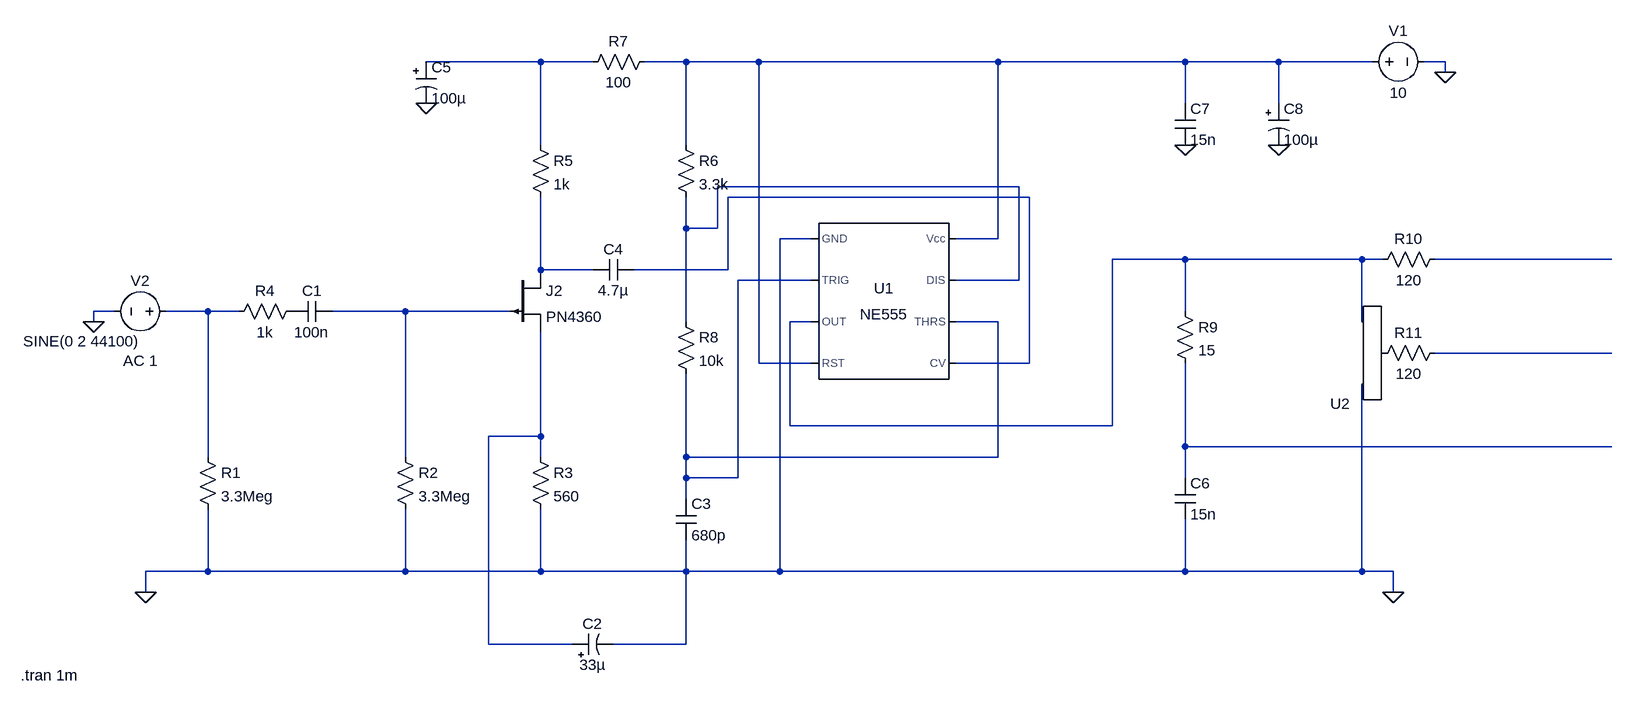
[diagram p0: schematic amplifier D.asc]
amplifier D.asc, the LTspice schematic file:
Version 4
SHEET 1 2276 1028
WIRE 624 64 448 64
WIRE 704 64 624 64
WIRE 848 64 784 64
WIRE 960 64 848 64
WIRE 1328 64 960 64
WIRE 1616 64 1328 64
WIRE 1760 64 1616 64
WIRE 1904 64 1760 64
WIRE 2016 64 1984 64
WIRE 2016 80 2016 64
WIRE 1616 128 1616 64
WIRE 1760 128 1760 64
WIRE 624 192 624 64
WIRE 848 192 848 64
WIRE 1360 256 896 256
WIRE 1376 272 912 272
WIRE 848 320 848 272
WIRE 896 320 896 256
WIRE 896 320 848 320
WIRE 1040 336 992 336
WIRE 1328 336 1328 64
WIRE 1328 336 1264 336
WIRE 1616 368 1504 368
WIRE 1888 368 1616 368
WIRE 1920 368 1888 368
WIRE 2272 368 2000 368
WIRE 624 384 624 272
WIRE 704 384 624 384
WIRE 912 384 912 272
WIRE 912 384 768 384
WIRE 1040 400 928 400
WIRE 1360 400 1360 256
WIRE 1360 400 1264 400
WIRE -32 448 -64 448
WIRE 112 448 48 448
WIRE 160 448 112 448
WIRE 416 448 304 448
WIRE 576 448 416 448
WIRE 1616 448 1616 368
WIRE -64 464 -64 448
WIRE 848 464 848 320
WIRE 1040 464 1008 464
WIRE 1328 464 1264 464
WIRE 1888 464 1888 368
WIRE 2272 512 2000 512
WIRE 960 528 960 64
WIRE 1040 528 960 528
WIRE 1376 528 1376 272
WIRE 1376 528 1264 528
WIRE 1008 624 1008 464
WIRE 1504 624 1504 368
WIRE 1504 624 1008 624
WIRE 624 640 624 480
WIRE 624 640 544 640
WIRE 1616 656 1616 528
WIRE 2272 656 1616 656
WIRE 112 672 112 448
WIRE 416 672 416 448
WIRE 624 672 624 640
WIRE 848 672 848 544
WIRE 1328 672 1328 464
WIRE 1328 672 848 672
WIRE 848 704 848 672
WIRE 928 704 928 400
WIRE 928 704 848 704
WIRE 1616 704 1616 656
WIRE 848 736 848 704
WIRE 112 848 112 752
WIRE 112 848 16 848
WIRE 416 848 416 752
WIRE 416 848 112 848
WIRE 624 848 624 752
WIRE 624 848 416 848
WIRE 848 848 848 800
WIRE 848 848 624 848
WIRE 992 848 992 336
WIRE 992 848 848 848
WIRE 1616 848 1616 768
WIRE 1616 848 992 848
WIRE 1888 848 1888 560
WIRE 1888 848 1616 848
WIRE 1936 848 1888 848
WIRE 16 880 16 848
WIRE 1936 880 1936 848
WIRE 544 960 544 640
WIRE 672 960 544 960
WIRE 848 960 848 848
WIRE 848 960 736 960
FLAG 16 880 0
FLAG 448 128 0
FLAG -64 464 0
FLAG 2016 80 0
FLAG 1936 880 0
FLAG 1616 192 0
FLAG 1760 192 0
SYMBOL voltage 64 448 R90
WINDOW 0 -32 56 VBottom 2
WINDOW 3 46 236 VLeft 2
WINDOW 123 60 56 VTop 2
WINDOW 39 0 0 Left 2
SYMATTR InstName V2
SYMATTR Value SINE(0 2 44100)
SYMATTR Value2 AC 1
SYMBOL res 96 656 R0
SYMATTR InstName R1
SYMATTR Value 3.3Meg
SYMBOL res 400 656 R0
SYMATTR InstName R2
SYMATTR Value 3.3Meg
SYMBOL res 608 656 R0
SYMATTR InstName R3
SYMATTR Value 560
SYMBOL res 256 432 R90
WINDOW 0 0 56 VBottom 2
WINDOW 3 32 56 VTop 2
SYMATTR InstName R4
SYMATTR Value 1k
SYMBOL cap 304 432 R90
WINDOW 0 0 32 VBottom 2
WINDOW 3 32 32 VTop 2
SYMATTR InstName C1
SYMATTR Value 100n
SYMBOL polcap 672 976 R270
WINDOW 0 32 32 VTop 2
WINDOW 3 0 32 VBottom 2
SYMATTR InstName C2
SYMATTR Value 33µ
SYMATTR SpiceLine V=16
SYMBOL cap 832 736 R0
SYMATTR InstName C3
SYMATTR Value 680p
SYMBOL cap 768 368 R90
WINDOW 0 0 32 VBottom 2
WINDOW 3 32 32 VTop 2
SYMATTR InstName C4
SYMATTR Value 4.7µ
SYMBOL res 608 176 R0
SYMATTR InstName R5
SYMATTR Value 1k
SYMBOL res 832 176 R0
SYMATTR InstName R6
SYMATTR Value 3.3k
SYMBOL res 800 48 R90
WINDOW 0 0 56 VBottom 2
WINDOW 3 32 56 VTop 2
SYMATTR InstName R7
SYMATTR Value 100
SYMBOL polcap 432 64 R0
SYMATTR InstName C5
SYMATTR Value 100µ
SYMATTR SpiceLine V=16
SYMBOL voltage 1888 64 R270
WINDOW 0 32 56 VTop 2
WINDOW 3 -32 56 VBottom 2
WINDOW 123 0 0 Left 2
WINDOW 39 0 0 Left 2
SYMATTR InstName V1
SYMATTR Value 10
SYMBOL Misc\\NE555 1152 432 R0
SYMATTR InstName U1
SYMBOL res 832 448 R0
SYMATTR InstName R8
SYMATTR Value 10k
SYMBOL res 1600 432 R0
SYMATTR InstName R9
SYMATTR Value 15
SYMBOL res 2016 352 R90
WINDOW 0 0 56 VBottom 2
WINDOW 3 32 56 VTop 2
SYMATTR InstName R10
SYMATTR Value 120
SYMBOL cap 1600 704 R0
SYMATTR InstName C6
SYMATTR Value 15n
SYMBOL EXTRA\\Misc\\pot 1888 512 R180
SYMATTR InstName U2
SYMBOL res 2016 496 R90
WINDOW 0 0 56 VBottom 2
WINDOW 3 32 56 VTop 2
SYMATTR InstName R11
SYMATTR Value 120
SYMBOL cap 1600 128 R0
SYMATTR InstName C7
SYMATTR Value 15n
SYMBOL polcap 1744 128 R0
SYMATTR InstName C8
SYMATTR Value 100µ
SYMATTR SpiceLine V=16
SYMBOL pjf 576 384 R0
SYMATTR InstName J2
SYMATTR Value PN4360
TEXT -176 1008 Left 2 !.tran 1m

The netlist it stands for:
* amplifier D.asc
V2 N009 0 SINE(0 2 44100) AC 1
R1 N009 0 3.3Meg
R2 N010 0 3.3Meg
R3 N012 0 560
R4 P001 N009 1k
C1 N010 P001 100n
C2 N012 0 33µ V=16
C3 N008 0 680p
C4 N004 N007 4.7µ
R5 N001 N007 1k
R6 N002 N003 3.3k
R7 N002 N001 100
C5 N001 0 100µ V=16
V1 N002 0 10
XU1 0 N008 N005 N002 N004 N008 N003 N002 NE555  ; pins GND TRIG OUT RST CV THRS DIS Vcc
R8 N003 N008 10k
R9 N005 N013 15
R10 N006 N005 120
C6 N013 0 15n
XU2 0 N005 P002 pot
R11 N011 P002 120
C7 N002 0 15n
C8 N002 0 100µ V=16
J2 N007 N010 N012 PN4360
.model NJF NJF
.model PJF PJF
.lib standard.jft
.tran 1m
.lib NE555.sub
.lib POT.lib
.backanno
.end